# EAGLE design ME433 (EAGLE 9.6.2)
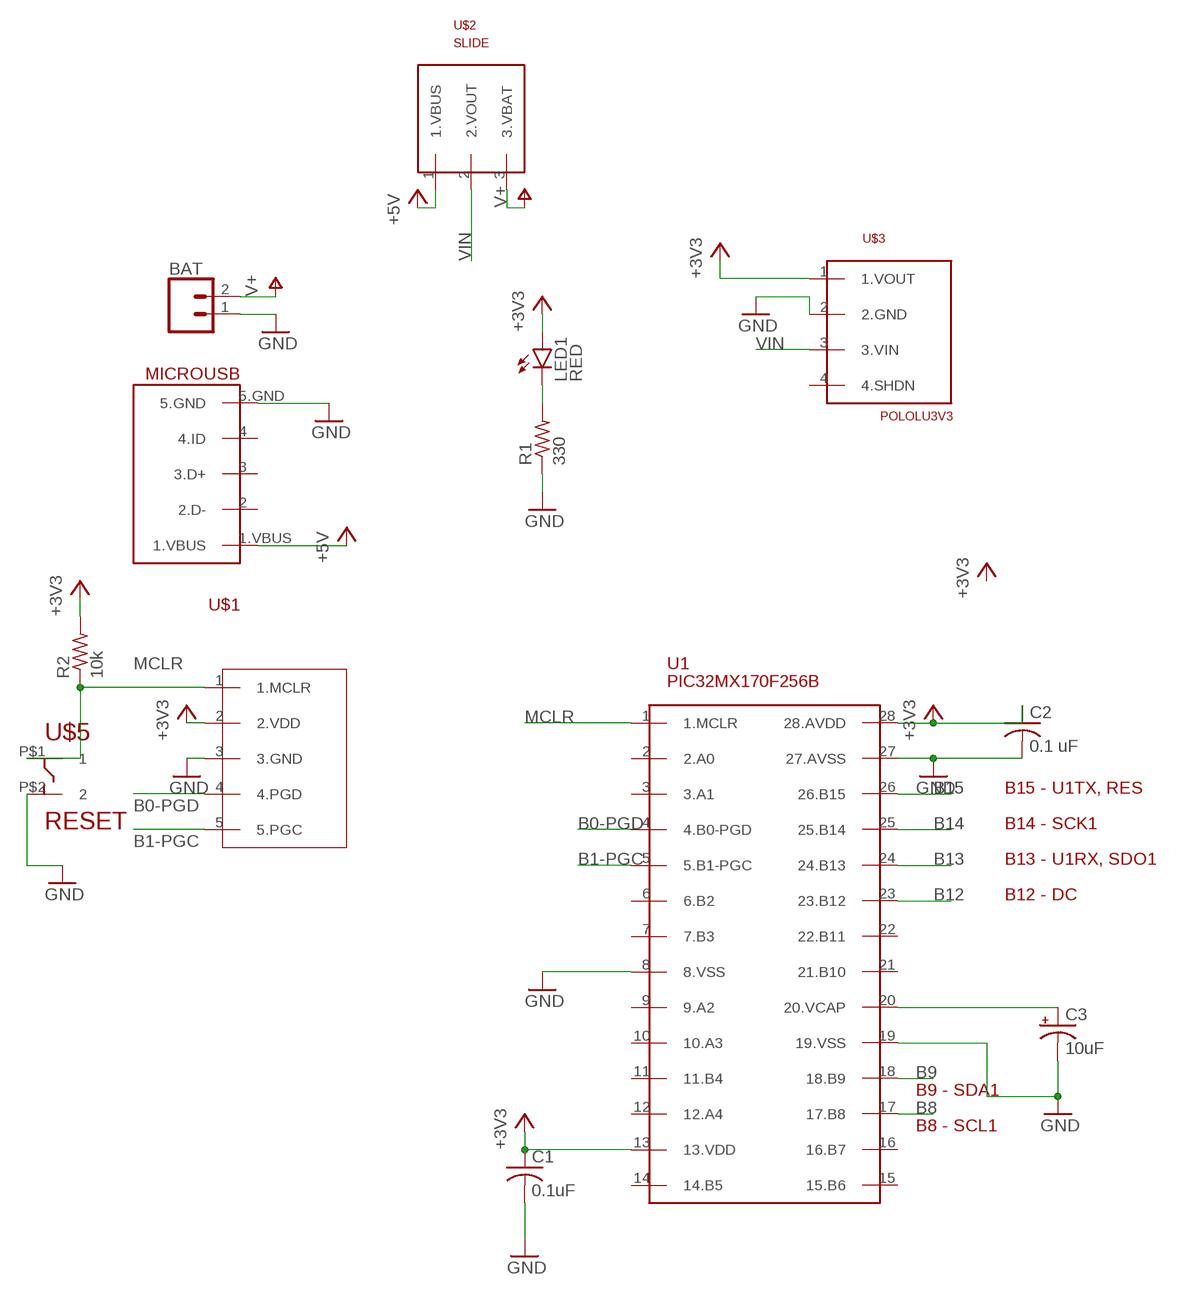
[diagram p0: schematic, sheet 1, part 1 of 2]
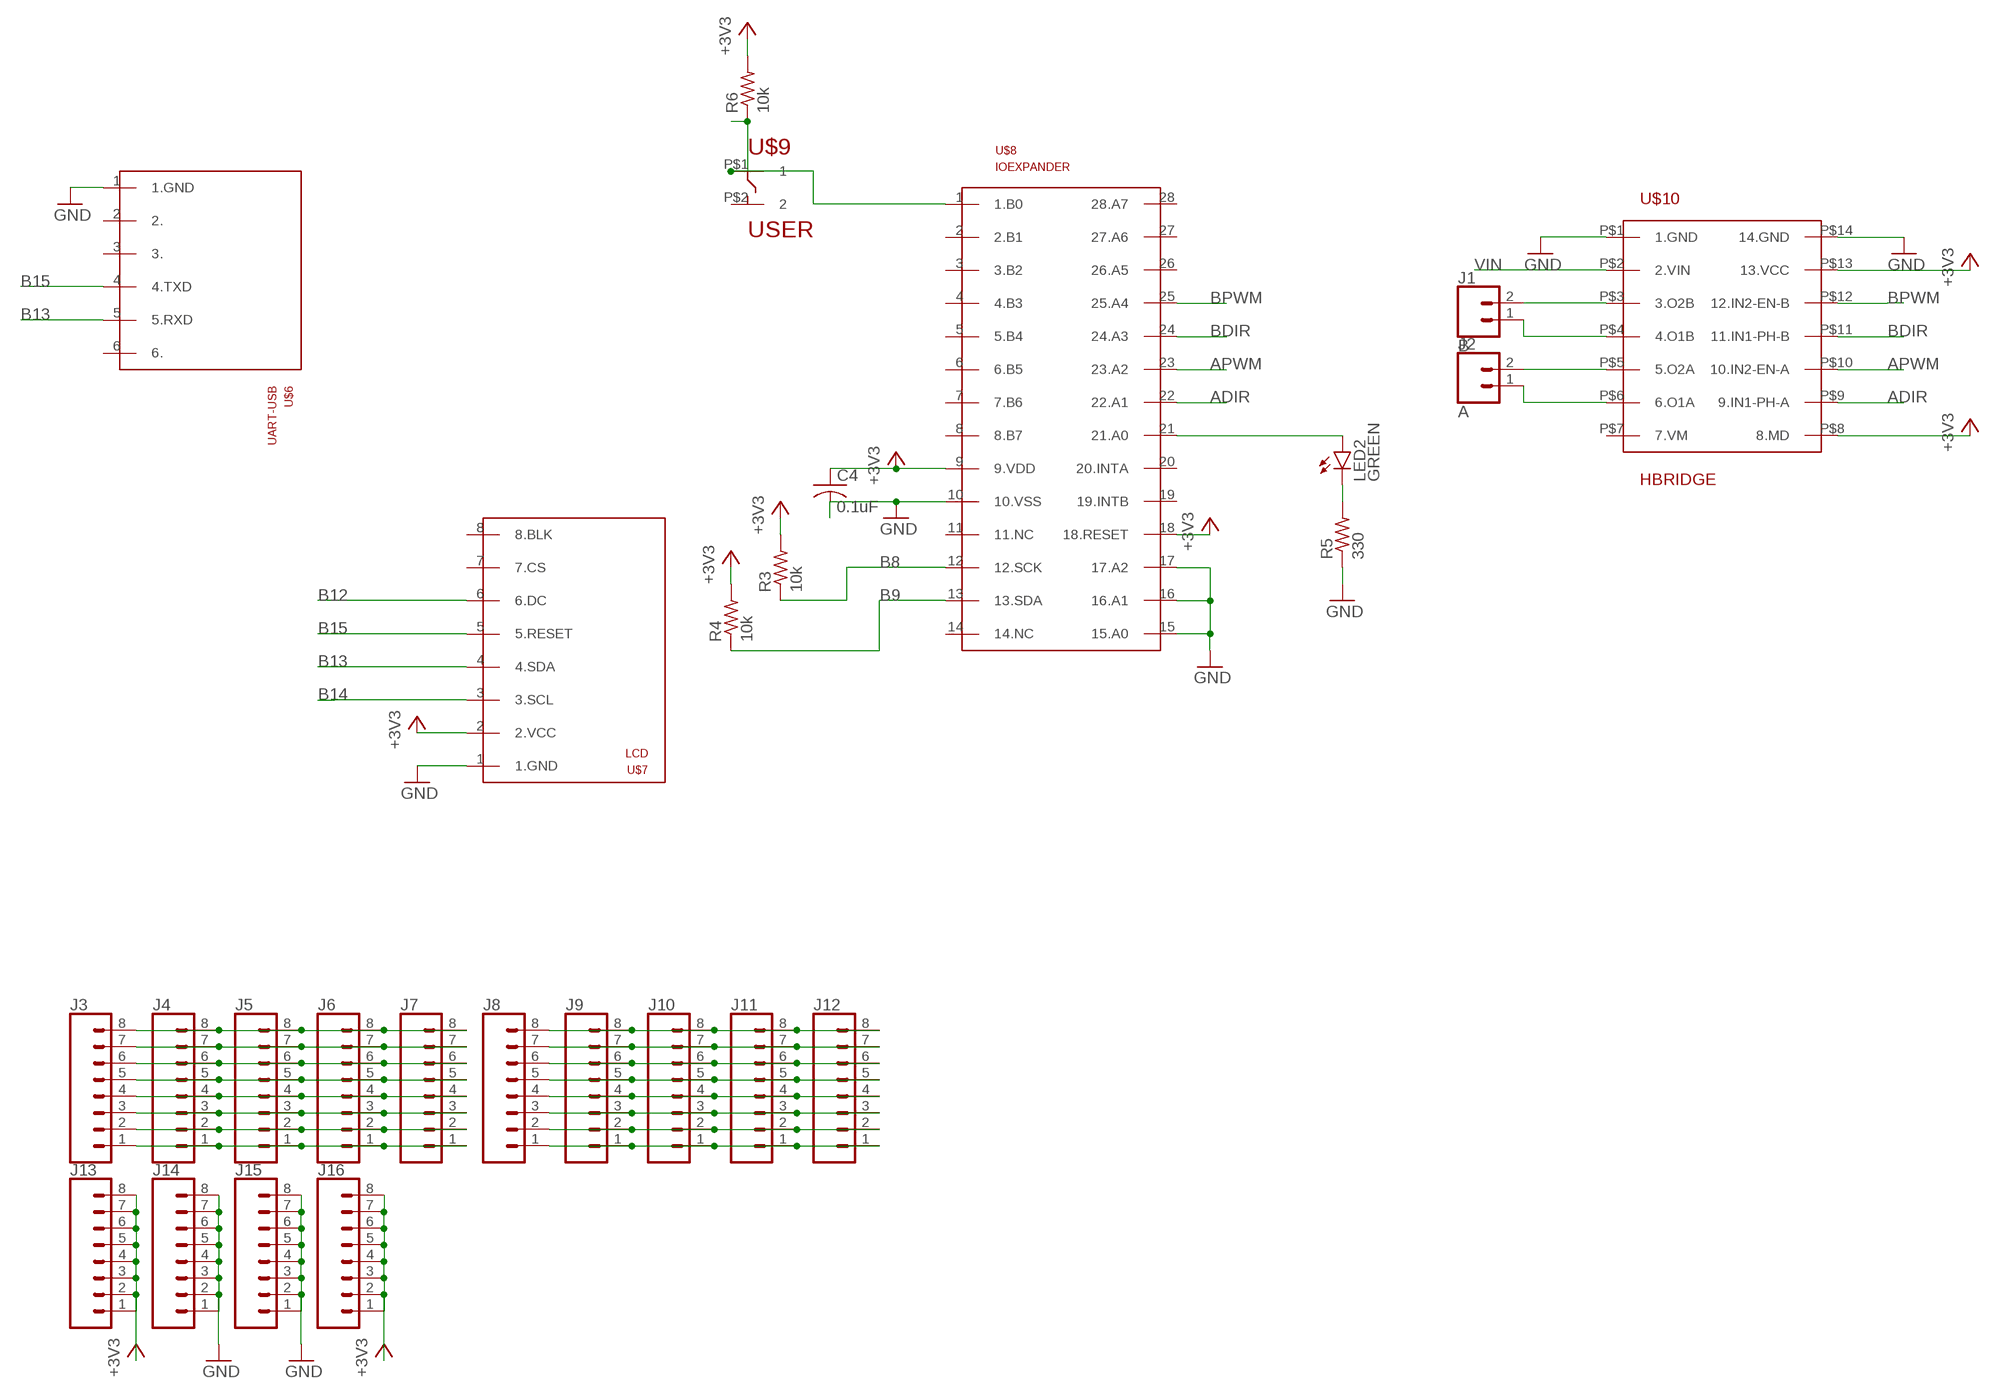
[diagram p1: schematic, sheet 1, part 2 of 2]

## Parts
BAT  CONN_02  [1X02]
C1  0.1uF  C-US025-030X050  [C025-030X050]
C2  0.1 uF  C-US025-030X050  [C025-030X050]
C3  10uF  CPOL-USB45181A  [B45181A]
C4  0.1uF  C-US025-030X050  [C025-030X050]
J1  B  CONN_02  [1X02]
J2  A  CONN_02  [1X02]
J3  CONN_08"  [1X08]
J4  CONN_08"  [1X08]
J5  CONN_08"  [1X08]
J6  CONN_08"  [1X08]
J7  CONN_08"  [1X08]
J8  CONN_08"  [1X08]
J9  CONN_08"  [1X08]
J10  CONN_08"  [1X08]
J11  CONN_08"  [1X08]
J12  CONN_08"  [1X08]
J13  CONN_08"  [1X08]
J14  CONN_08"  [1X08]
J15  CONN_08"  [1X08]
J16  CONN_08"  [1X08]
LED1  RED  LED3MM  [LED3MM]
LED2  GREEN  LED3MM  [LED3MM]
R1  330  R-US_0207/10  [0207/10]
R2  10k  R-US_0207/10  [0207/10]
R3  10k  R-US_0207/10  [0207/10]
R4  10k  R-US_0207/10  [0207/10]
R5  330  R-US_0207/10  [0207/10]
R6  10k  R-US_0207/10  [0207/10]
U1  PIC32MX170F256B  [DIL28-3]
U$1  MICROUSB  [MICROUSB]
U$2  SLIDE  [SLIDE]
U$3  POLOLU3V3  [POLOLU3V3]
U$4  SNAP  [SNAP]
U$5  RESET  PUSH  [PUSH]
U$6  UART-USB  [UART-USB]
U$7  LCD  [LCD]
U$8  IOEXPANDER  [IOEXPANDER]
U$9  USER  PUSH  [PUSH]
U$10  HBRIDGE  [HBRIDGE]

## Nets
+3V3: C1.1 C2.1 C4.1 J13.1 J13.2 J13.3 J13.4 J13.5 J13.6 J13.7 J13.8 J16.1 J16.2 J16.3 J16.4 J16.5 J16.6 J16.7 J16.8 LED1.A R2.2 R3.2 R4.2 R6.2 U1.13(13.VDD) U1.28(28.AVDD) U$3.1(1.VOUT) U$4.2(2.VDD) U$7.2(2.VCC) U$8.9(9.VDD) U$8.18(18.RESET) U$10.P$8(8.MD) U$10.P$13(13.VCC)
+5V: U$1.1.VBUS U$2.1(1.VBUS)
ADIR: U$8.22(22.A1) U$10.P$9(9.IN1-PH-A)
APWM: U$8.23(23.A2) U$10.P$10(10.IN2-EN-A)
B0-PGD: U1.4(4.B0-PGD) U$4.4(4.PGD)
B1-PGC: U1.5(5.B1-PGC) U$4.5(5.PGC)
B8: R3.1 U1.17(17.B8) U$8.12(12.SCK)
B9: R4.1 U1.18(18.B9) U$8.13(13.SDA)
B12: U1.23(23.B12) U$7.6(6.DC)
B13: U1.24(24.B13) U$6.5(5.RXD) U$7.4(4.SDA)
B14: U1.25(25.B14) U$7.3(3.SCL)
B15: U1.26(26.B15) U$6.4(4.TXD) U$7.5(5.RESET)
BDIR: U$8.24(24.A3) U$10.P$11(11.IN1-PH-B)
BPWM: U$8.25(25.A4) U$10.P$12(12.IN2-EN-B)
GND: BAT.1 C1.2 C2.2 C3.- C4.2 J14.1 J14.2 J14.3 J14.4 J14.5 J14.6 J14.7 J14.8 J15.1 J15.2 J15.3 J15.4 J15.5 J15.6 J15.7 J15.8 R1.1 R5.1 U1.8(8.VSS) U1.19(19.VSS) U1.27(27.AVSS) U$1.5.GND U$3.2(2.GND) U$4.3(3.GND) U$5.P$2 U$6.1(1.GND) U$7.1(1.GND) U$8.10(10.VSS) U$8.15(15.A0) U$8.16(16.A1) U$8.17(17.A2) U$10.P$1(1.GND) U$10.P$14(14.GND)
MCLR: R2.1 U1.1(1.MCLR) U$4.1(1.MCLR) U$5.P$1
N$1: LED1.K(C) R1.2
N$2: J1.2 U$10.P$3(3.O2B)
N$3: C3.+ U1.20(20.VCAP)
N$4: J1.1 U$10.P$4(4.O1B)
N$6: LED2.A U$8.21(21.A0)
N$7: LED2.K(C) R5.2
N$8: J2.2 U$10.P$5(5.O2A)
N$9: J2.1 U$10.P$6(6.O1A)
N$10: J3.8 J4.8 J5.8 J6.8 J7.8
N$11: J3.7 J4.7 J5.7 J6.7 J7.7
N$12: J3.6 J4.6 J5.6 J6.6 J7.6
N$13: J3.5 J4.5 J5.5 J6.5 J7.5
N$14: J3.4 J4.4 J5.4 J6.4 J7.4
N$15: J3.3 J4.3 J5.3 J6.3 J7.3
N$16: J3.2 J4.2 J5.2 J6.2 J7.2
N$17: J3.1 J4.1 J5.1 J6.1 J7.1
N$18: J8.8 J9.8 J10.8 J11.8 J12.8
N$19: J8.7 J9.7 J10.7 J11.7 J12.7
N$20: J8.6 J9.6 J10.6 J11.6 J12.6
N$21: J8.5 J9.5 J10.5 J11.5 J12.5
N$22: J8.4 J9.4 J10.4 J11.4 J12.4
N$23: J8.3 J9.3 J10.3 J11.3 J12.3
N$24: J8.2 J9.2 J10.2 J11.2 J12.2
N$25: J8.1 J9.1 J10.1 J11.1 J12.1
N$26: R6.1 U$8.1(1.B0) U$9.P$1
V+: BAT.2 U$2.3(3.VBAT)
VIN: U$2.2(2.VOUT) U$3.3(3.VIN) U$10.P$2(2.VIN)
Unconnected: U1.2(2.A0) U1.3(3.A1) U1.6(6.B2) U1.7(7.B3) U1.9(9.A2) U1.10(10.A3) U1.11(11.B4) U1.12(12.A4) U1.14(14.B5) U1.15(15.B6) U1.16(16.B7) U1.21(21.B10) U1.22(22.B11) U$1.2(2.D-) U$1.3(3.D+) U$1.4(4.ID) U$3.4(4.SHDN) U$6.2(2.) U$6.3(3.) U$6.6(6.) U$7.7(7.CS) U$7.8(8.BLK) U$8.2(2.B1) U$8.3(3.B2) U$8.4(4.B3) U$8.5(5.B4) U$8.6(6.B5) U$8.7(7.B6) U$8.8(8.B7) U$8.11(11.NC) U$8.14(14.NC) U$8.19(19.INTB) U$8.20(20.INTA) U$8.26(26.A5) U$8.27(27.A6) U$8.28(28.A7) U$9.P$2 U$10.P$7(7.VM)

## Notes on the sheet
- B15 - U1TX, RES
- B14 - SCK1
- B13 - U1RX, SDO1
- B12 - DC
- B9 - SDA1
- B8 - SCL1

## Library data of the parts
BAT J1 J2 = ME433:CONN_02: Multi connection point. Often used as Generic Header-pin footprint for 0.1 inch spaced/style header connections On any of the 0.1 inch spaced packages, you can populate with these: Break Away Headers - Straight <https://www.sparkfun.com/products/116> (PRT-00116) Break Away Male Headers - Right Angle <https://www.sparkfun.com/products/553> (PRT-00553) Female Headers <https://www.sparkfun.com/products/115> (PRT-00115) Break Away Headers - Machine Pin <https://www.sparkfun.com/products/117> (PRT-00117) Break Away Female Headers - Swiss Machine Pin <https://www.sparkfun.com/products/743> (PRT-00743) For SCREWTERMINALS and SPRING TERMINALS visit here: Screw Terimnals on SparkFun.com <https://www.sparkfun.com/search/results?term=Screw+Terminals> (5mm/3.5mm/2.54mm spacing) This device is also useful as a general connection point to wire up your design to another part of your project. Our various solder wires solder well into these plated through hole pads. Hook-Up Wire - Assortment (Stranded, 22 AWG) <https://www.sparkfun.com/products/11375> (PRT-11375) Hook-Up Wire - Assortment (Solid Core, 22 AWG) <https://www.sparkfun.com/products/11367> (PRT-11367) View the entire wire category on our website here <https://www.sparkfun.com/categories/141> Special notes: Molex polarized connector foot print use with: PRT-08233 with associated crimp pins and housings. 2.54_SCREWTERM for use with PRT-10571. 3.5mm Screw Terminal footprints for PRT-08084 5mm Screw Terminal footprints for use with PRT-08432
C1 C2 C4 = ME433:C-US: CAPACITOR, American symbol; SPICEPREFIX: C
C3 = ME433:CPOL-US: POLARIZED CAPACITOR, American symbol; SPICEPREFIX: C
J3-J16 = ME433:CONN_08: Multi connection point. Often used as Generic Header-pin footprint for 0.1 inch spaced/style header connections On any of the 0.1 inch spaced packages, you can populate with these: Break Away Headers - Straight <https://www.sparkfun.com/products/116> (PRT-00116) Break Away Male Headers - Right Angle <https://www.sparkfun.com/products/553> (PRT-00553) Female Headers <https://www.sparkfun.com/products/115> (PRT-00115) Break Away Headers - Machine Pin <https://www.sparkfun.com/products/117> (PRT-00117) Break Away Female Headers - Swiss Machine Pin <https://www.sparkfun.com/products/743> (PRT-00743) Arduino Stackable Header - 8 Pin <https://www.sparkfun.com/products/9279> (PRT-09279) For SCREWTERMINALS and SPRING TERMINALS visit here: Screw Terimnals on SparkFun.com <https://www.sparkfun.com/search/results?term=Screw+Terminals> (5mm/3.5mm/2.54mm spacing) This device is also useful as a general connection point to wire up your design to another part of your project. Our various solder wires solder well into these plated through hole pads. Hook-Up Wire - Assortment (Stranded, 22 AWG) <https://www.sparkfun.com/products/11375> (PRT-11375) Hook-Up Wire - Assortment (Solid Core, 22 AWG) <https://www.sparkfun.com/products/11367> (PRT-11367) View the entire wire category on our website here <https://www.sparkfun.com/categories/141> Special notes: Molex polarized connector foot print use with SKU : PRT-08231 with associated crimp pins and housings. 1MM SMD Version SKU: PRT-10208 NOTES ON THE VARIANTS LOCK and LOCK_LONGPADS... This footprint was designed to help hold the alignment of a through-hole component (i.e. 6-pin header) while soldering it into place. You may notice that each hole has been shifted either up or down by 0.005 of an inch from it's more standard position (which is a perfectly straight line). This slight alteration caused the pins (the squares in the middle) to touch the edges of the holes. Because they are alternating, it causes a "brace" to hold the component in place. 0.005 has proven to be the perfect amount of "off-center" position when using our standard breakaway headers. Although looks a little odd when you look at the bare footprint, once you have a header in there, the alteration is very hard to notice. Also,if you push a header all the way into place, it is covered up entirely on the bottom side.; PROD_ID: CONN-08438
LED1 LED2 = ME433:LED: LED OSRAM: - CHIPLED LG R971, LG N971, LY N971, LG Q971, LY Q971, LO R971, LY R971 LH N974, LH R974 LS Q976, LO Q976, LY Q976 LO Q996 - Hyper CHIPLED LW Q18S LB Q993, LB Q99A, LB R99A - SideLED LS A670, LO A670, LY A670, LG A670, LP A670 LB A673, LV A673, LT A673, LW A673 LH A674 LY A675 LS A676, LA A676, LO A676, LY A676, LW A676 LS A679, LY A679, LG A679 - Hyper Micro SIDELED® LS Y876, LA Y876, LO Y876, LY Y876 LT Y87S - SmartLED LW L88C, LW L88S LB L89C, LB L89S, LG L890 LS L89K, LO L89K, LY L89K LS L896, LA L896, LO L896, LY L896 - TOPLED LS T670, LO T670, LY T670, LG T670, LP T670 LSG T670, LSP T670, LSY T670, LOP T670, LYG T670 LG T671, LOG T671, LSG T671 LB T673, LV T673, LT T673, LW T673 LH T674 LS T676, LA T676, LO T676, LY T676, LB T676, LH T676, LSB T676, LW T676 LB T67C, LV T67C, LT T67C, LS T67K, LO T67K, LY T67K, LW E67C LS E67B, LA E67B, LO E67B, LY E67B, LB E67C, LV E67C, LT E67C LW T67C LS T679, LY T679, LG T679 LS T770, LO T770, LY T770, LG T770, LP T770 LB T773, LV T773, LT T773, LW T773 LH T774 LS E675, LA E675, LY E675, LS T675 LS T776, LA T776, LO T776, LY T776, LB T776 LHGB T686 LT T68C, LB T68C - Hyper Mini TOPLED® LB M676 - Mini TOPLED Santana® LG M470 LS M47K, LO M47K, LY M47K Source: http://www.osram.convergy.de LUXEON: - LUMILED® LXK2-PW12-R00, LXK2-PW12-S00, LXK2-PW14-U00, LXK2-PW14-V00 LXK2-PM12-R00, LXK2-PM12-S00, LXK2-PM14-U00 LXK2-PE12-Q00, LXK2-PE12-R00, LXK2-PE12-S00, LXK2-PE14-T00, LXK2-PE14-U00 LXK2-PB12-K00, LXK2-PB12-L00, LXK2-PB12-M00, LXK2-PB14-N00, LXK2-PB14-P00, LXK2-PB14-Q00 LXK2-PR12-L00, LXK2-PR12-M00, LXK2-PR14-Q00, LXK2-PR14-R00 LXK2-PD12-Q00, LXK2-PD12-R00, LXK2-PD12-S00 LXK2-PH12-R00, LXK2-PH12-S00 LXK2-PL12-P00, LXK2-PL12-Q00, LXK2-PL12-R00 Source: www.luxeon.com KINGBRIGHT: KA-3528ASYC Source: www.kingbright.com
R1-R6 = ME433:R-US_: RESISTOR, American symbol; SPICEPREFIX: R
U1 = ME433:PIC32MX170F256B
U$1 = ME433:MICROUSB
U$2 = ME433:SLIDE
U$3 = ME433:POLOLU3V3
U$4 = ME433:SNAP
U$5 U$9 = ME433:PUSH
U$6 = ME433:UART-USB
U$7 = ME433:LCD
U$8 = ME433:IOEXPANDER
U$10 = ME433:HBRIDGE

## Board
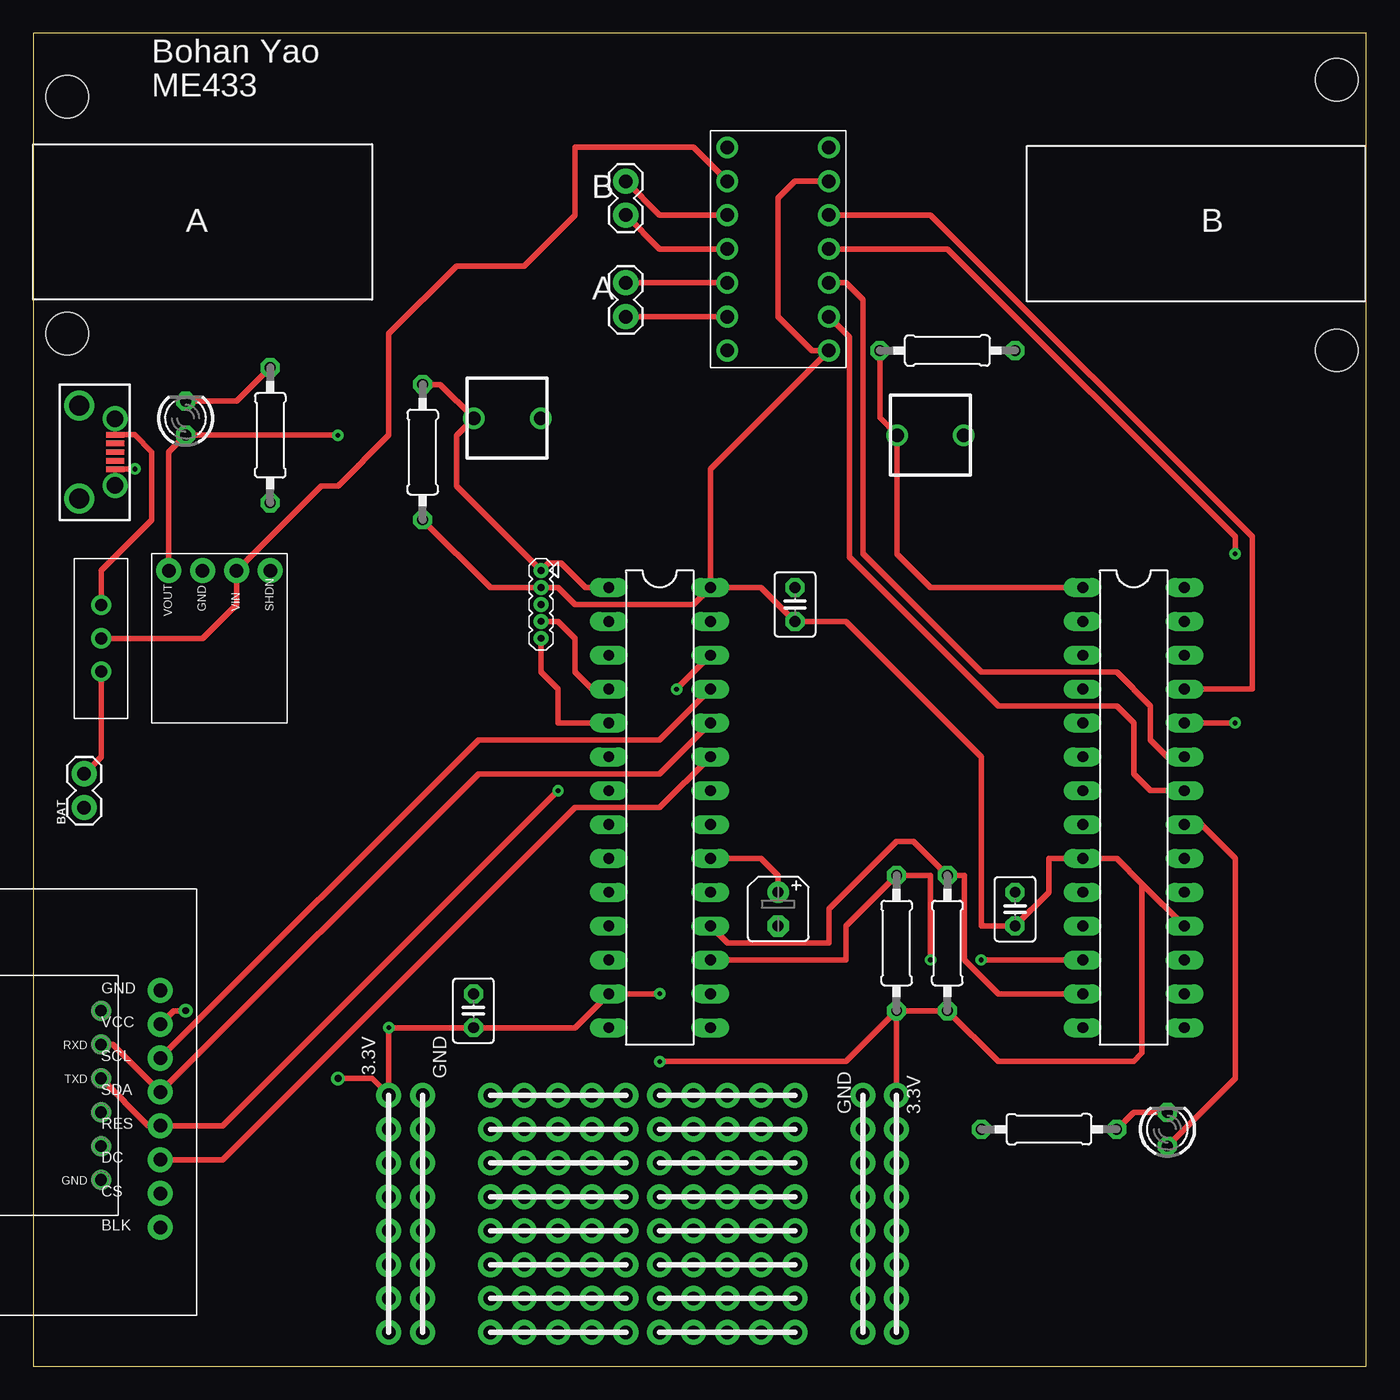
[diagram p2: board, top side]
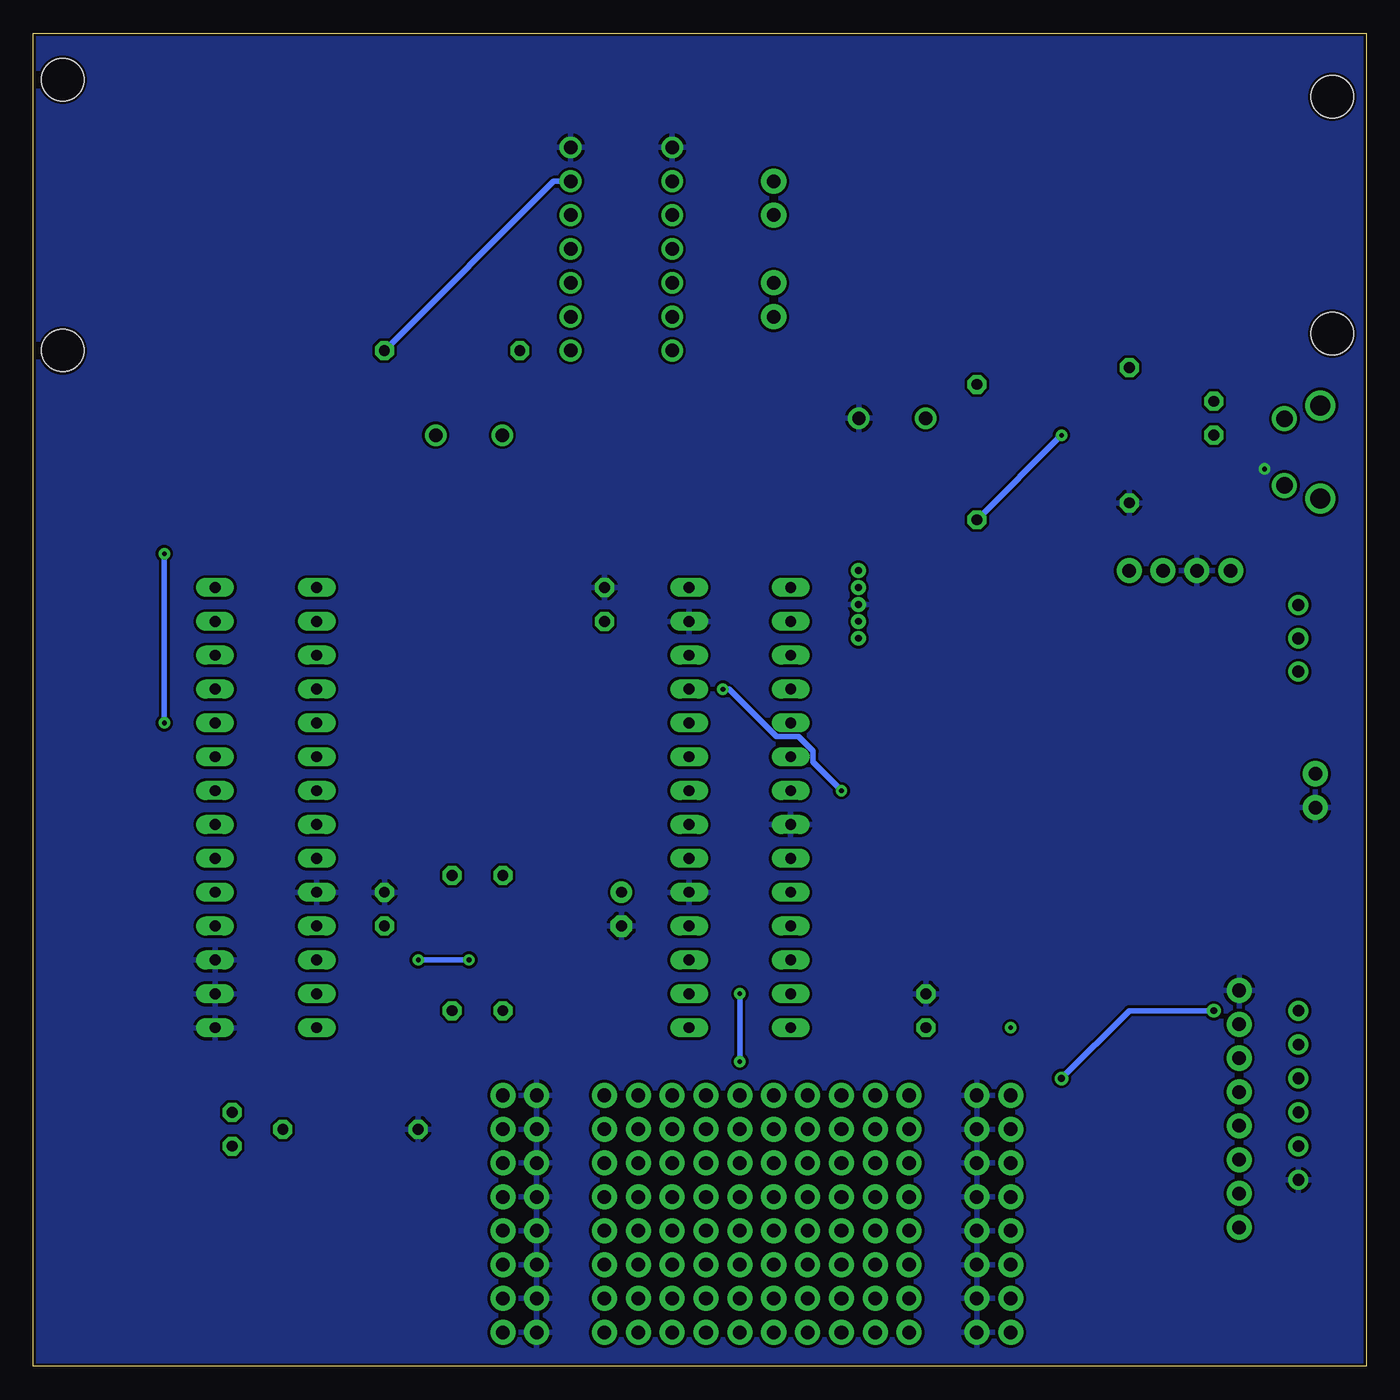
[diagram p3: board, bottom side, seen from below]

Size 100 x 100 mm. Coordinates in mm from the lower left corner, seen from the top.
Outline: 0,0 100,0 100,100 0,100 0,0
Copper layers (1*16): Top 0.035mm / dielectric 1.5mm / Bottom 0.035mm
Design rules "SparkFun": minimum track width 8mil, minimum drill 20mil, track to track 8mil, track to pad 8mil, pad to pad 8mil, via to via 8mil, smd to smd 8mil, copper to edge 8mil, drill to drill 8mil, minimum pad ring 12mil, minimum via ring 10mil, stop-mask expansion 4mil, vias tented up to drill 20mil, thermal gap 10mil
Holes 3.17 mm at 2.54,95.25 2.54,77.47 97.79,96.52 97.79,76.2

### Footprints (pad centres in the part's own frame; a part is rotated, then mirrored left to right if it is on the bottom)
1X02 = drill 1.016 pad 1.88: 1 0,0; 2 2.54,0
C025-030X050 = drill 0.813 octagon: 1 -1.27,0; 2 1.27,0
B45181A = drill 0.813 pad 1.6: + -1.27,0 | drill 0.813 pad 1.6 octagon: - 1.27,0
1X08 = drill 1.016 pad 1.88: 1 0,0; 2 2.54,0; 3 5.08,0; 4 7.62,0; 5 10.16,0; 6 12.7,0; 7 15.24,0; 8 17.78,0
LED3MM = drill 0.813 octagon: A -1.27,0; K 1.27,0
0207/10 = drill 0.813 octagon: 1 -5.08,0; 2 5.08,0
DIL28-3 = drill 0.813 long: 1 -16.51,-3.81; 2 -13.97,-3.81; 3 -11.43,-3.81; 4 -8.89,-3.81; 5 -6.35,-3.81; 6 -3.81,-3.81; 7 -1.27,-3.81; 8 1.27,-3.81; 9 3.81,-3.81; 10 6.35,-3.81; 11 8.89,-3.81; 12 11.43,-3.81; 13 13.97,-3.81; 14 16.51,-3.81; 15 16.51,3.81; 16 13.97,3.81; 17 11.43,3.81; 18 8.89,3.81; 19 6.35,3.81; 20 3.81,3.81; 21 1.27,3.81; 22 -1.27,3.81; 23 -3.81,3.81; 24 -6.35,3.81; 25 -8.89,3.81; 26 -11.43,3.81; 27 -13.97,3.81; 28 -16.51,3.81
MICROUSB = smd 0.4 x 1.35: 1.VBUS -1.3,2.7; 2 -0.65,2.7; 3 0,2.7; 4 0.65,2.7; 5.GND 1.3,2.7 | drill 1.25 pad 1.676: P$6 -2.5,2.7; P$7 2.5,2.7 | drill 1.5: P$8 -3.5,0; P$9 3.5,0
SLIDE = drill 0.9: 1 -2.5,0; 2 0,0; 3 2.5,0
POLOLU3V3 = drill 1.016 pad 1.88: 1 0,3.81; 2 0,1.27; 3 0,-1.27; 4 0,-3.81
SNAP = drill 0.508 pad 1: 1 1.27,0; 2 1.27,-1.27; 3 1.27,-2.54; 4 1.27,-3.81; 5 1.27,-5.08
PUSH = drill 1: P$1 -2.5,0; P$2 2.5,0
UART-USB = drill 0.889 pad 0.813: 1 -6.35,1.27; 2 -3.81,1.27; 3 -1.27,1.27; 4 1.27,1.27; 5 3.81,1.27; 6 6.35,1.27
LCD = drill 1.016 pad 1.88: 1 41.275,24.384; 2 41.275,21.844; 3 41.275,19.304; 4 41.275,16.764; 5 41.275,14.224; 6 41.275,11.684; 7 41.275,9.144; 8 41.275,6.604
IOEXPANDER = drill 0.813 long: 1 -16.51,-3.81; 2 -13.97,-3.81; 3 -11.43,-3.81; 4 -8.89,-3.81; 5 -6.35,-3.81; 6 -3.81,-3.81; 7 -1.27,-3.81; 8 1.27,-3.81; 9 3.81,-3.81; 10 6.35,-3.81; 11 8.89,-3.81; 12 11.43,-3.81; 13 13.97,-3.81; 14 16.51,-3.81; 15 16.51,3.81; 16 13.97,3.81; 17 11.43,3.81; 18 8.89,3.81; 19 6.35,3.81; 20 3.81,3.81; 21 1.27,3.81; 22 -1.27,3.81; 23 -3.81,3.81; 24 -6.35,3.81; 25 -8.89,3.81; 26 -11.43,3.81; 27 -13.97,3.81; 28 -16.51,3.81
HBRIDGE = drill 1.016: P$1 -2.54,7.62; P$2 -2.54,5.08; P$3 -2.54,2.54; P$4 -2.54,0; P$5 -2.54,-2.54; P$6 -2.54,-5.08; P$7 -2.54,-7.62; P$8 5.08,-7.62; P$9 5.08,-5.08; P$10 5.08,-2.54; P$11 5.08,0; P$12 5.08,2.54; P$13 5.08,5.08; P$14 5.08,7.62

### Placement (x,y rotation side)
BAT  3.81,41.91 90 top
C1  57.15,57.15 90 top
C2  33.02,26.67 90 top
C3  55.88,34.29 270 top
C4  73.66,34.29 90 top
J1  44.45,86.36 90 top
J2  44.45,78.74 90 top
J3  34.29,2.54 90 top
J4  36.83,2.54 90 top
J5  39.37,2.54 90 top
J6  41.91,2.54 90 top
J7  44.45,2.54 90 top
J8  46.99,2.54 90 top
J9  49.53,2.54 90 top
J10  52.07,2.54 90 top
J11  54.61,2.54 90 top
J12  57.15,2.54 90 top
J13  26.67,2.54 90 top
J14  29.21,2.54 90 top
J15  62.23,2.54 90 top
J16  64.77,2.54 90 top
LED1  11.43,71.12 90 top
LED2  85.09,17.78 90 top
R1  17.78,69.85 90 top
R2  29.21,68.58 270 top
R3  64.77,31.75 270 top
R4  68.58,31.75 270 top
R5  76.2,17.78 0 top
R6  68.58,76.2 0 top
U1  46.99,41.91 270 top
U$1  3.43,68.58 270 top
U$2  5.08,54.61 270 top
U$3  13.97,59.69 90 top
U$4  36.83,59.69 0 top
U$5  35.56,71.12 0 top
U$6  6.35,20.32 90 top
U$7  -31.75,3.81 0 top
U$8  82.55,41.91 270 top
U$9  67.31,69.85 0 top
U$10  54.61,83.82 0 top

### Tracks (layer width: path | path; a pad name or v marks a point on that pad's centre or on a via)
+3V3  (via drill 0.35, 0.51)
  Top 0.406: U$3.1 10.16,68.58 LED1.A v22.86,69.85 | R2.2 34.29,58.42 U$4.2 39.37,58.42 40.64,57.15 49.53,57.15 U1.28 | U1.28 54.61,58.42 C1.1 60.96,55.88 71.12,45.72 71.12,33.02 C4.1 76.2,35.56 76.2,38.1 U$8.9 81.28,38.1 83.19,36.2 | U1.28 50.8,67.31 U$10.P$8 58.42,76.2 55.88,78.74 55.88,87.63 57.15,88.9 U$10.P$13 | 83.19,36.2 U$8.18 | 83.19,36.2 83.19,23.5 82.55,22.86 72.39,22.86 R4.2 R3.2 | R3.2 J16.8 J16.7 J16.6 J16.5 J16.4 J16.3 J16.2 J16.1 | R3.2 60.96,22.86 v46.99,22.86 | v46.99,27.94 U1.13 40.64,25.4 C2.1 v26.67,25.4 J13.8 | J13.8 J13.7 J13.6 J13.5 J13.4 J13.3 J13.2 J13.1 | v11.43,26.67 10.54,26.67 U$7.2 | v22.86,21.59 25.4,21.59 J13.8
  Bottom 0.406: v22.86,69.85 R2.2 | v46.99,22.86 v46.99,27.94 | U$10.P$13 60.96,88.9 R6.2 | v11.43,26.67 17.78,26.67 v22.86,21.59
+5V
  Top 0.406: U$1.1.VBUS 7.59,69.88 8.89,68.58 8.89,63.5 5.08,59.69 U$2.1
ADIR
  Top 0.406: U$10.P$9 61.21,77.22 61.21,60.71 72.39,49.53 81.28,49.53 82.55,48.26 82.55,44.45 83.82,43.18 U$8.22
APWM
  Top 0.406: U$10.P$10 60.96,81.28 62.23,80.01 62.23,60.96 71.12,52.07 81.28,52.07 83.82,49.53 83.82,46.99 85.09,45.72 U$8.23
B0-PGD
  Top 0.406: U$4.4 39.37,55.88 40.64,54.61 40.64,52.07 41.91,50.8 U1.4
B1-PGC
  Top 0.406: U$4.5 38.1,52.07 39.37,50.8 39.37,48.26 U1.5
B8  (via drill 0.35)
  Top 0.406: U$8.12 v71.12,30.48 | v67.31,30.48 67.31,36.83 R3.1 60.96,33.02 60.96,30.48 U1.17
  Bottom 0.406: v71.12,30.48 v67.31,30.48
B9
  Top 0.406: U$8.13 72.39,27.94 69.85,30.48 69.85,36.83 R4.1 66.04,39.37 64.77,39.37 59.69,34.29 59.69,31.75 52.07,31.75 U1.18
B12
  Top 0.406: U$7.6 14.22,15.49 40.64,41.91 46.99,41.91 U1.23
B13
  Top 0.406: U1.24 46.99,44.45 33.4,44.45 U$7.4 5.97,24.13 U$6.5
B14
  Top 0.406: U$7.3 33.4,46.99 46.99,46.99 U1.25
B15  (via drill 0.35)
  Top 0.406: v39.37,43.18 14.22,18.03 10.16,18.03 U$7.5 8.64,18.03 U$6.4 | v48.26,50.8 U1.26
  Bottom 0.406: v39.37,43.18 41.5,45.31 41.5,46.14 42.61,47.24 44.26,47.24 47.82,50.8 v48.26,50.8
BDIR  (via drill 0.35)
  Top 0.406: U$10.P$11 68.58,83.82 90.17,62.23 v90.17,60.96 | v90.17,48.26 U$8.24
  Bottom 0.406: v90.17,60.96 v90.17,48.26
BPWM
  Top 0.406: U$10.P$12 67.31,86.36 91.44,62.23 91.44,50.8 U$8.25
GND  (via drill 0.35)
  Top 0.406: U$1.5.GND 6.16,67.31 v7.62,67.31
  pour Bottom (isolate 0): 0,0 100.33,0 100.33,100.33 0,100.33
MCLR
  Top 0.406: U1.1 41.43,58.42 39.6,60.25 38.66,60.25 U$4.1 31.75,66.04 31.75,69.81 U$5.P$1 30.52,73.66 R2.1
N$1
  Top 0.406: LED1.K 15.24,72.39 R1.2
N$2
  Top 0.406: J1.2 46.99,86.36 U$10.P$3
N$3
  Top 0.406: C3.+ 55.88,36.83 54.61,38.1 U1.20
N$4
  Top 0.406: U$10.P$4 46.99,83.82 J1.1
N$6
  Top 0.406: LED2.A 90.17,21.59 90.17,38.1 87.63,40.64 U$8.21
N$7
  Top 0.406: R5.2 82.55,19.05 LED2.K
N$8
  Top 0.406: J2.2 U$10.P$5
N$9
  Top 0.406: U$10.P$6 J2.1
N$10
  Top 0.406: J3.8 J4.8 J5.8 J6.8 J7.8
N$11
  Top 0.406: J3.7 J4.7 J5.7 J6.7 J7.7
N$12
  Top 0.406: J3.6 J4.6 J5.6 J6.6 J7.6
N$13
  Top 0.406: J3.5 J4.5 J5.5 J6.5 J7.5
N$14
  Top 0.406: J3.4 J4.4 J5.4 J6.4 J7.4
N$15
  Top 0.406: J3.3 J4.3 J5.3 J6.3 J7.3
N$16
  Top 0.406: J3.2 J4.2 J5.2 J6.2 J7.2
N$17
  Top 0.406: J3.1 J4.1 J5.1 J6.1 J7.1
N$18
  Top 0.406: J8.8 J9.8 J10.8 J11.8 J12.8
N$19
  Top 0.406: J12.7 J11.7 J10.7 J9.7 J8.7
N$20
  Top 0.406: J8.6 J9.6 J10.6 J11.6 J12.6
N$21
  Top 0.406: J12.5 J11.5 J10.5 J9.5 J8.5
N$22
  Top 0.406: J8.4 J9.4 J10.4 J11.4 J12.4
N$23
  Top 0.406: J8.3 J9.3 J10.3 J11.3 J12.3
N$24
  Top 0.406: J12.2 J11.2 J10.2 J9.2 J8.2
N$25
  Top 0.406: J8.1 J9.1 J10.1 J11.1 J12.1
N$26
  Top 0.406: R6.1 63.5,71.16 U$9.P$1 64.81,60.92 67.31,58.42 U$8.1
V+
  Top 0.406: BAT.2 5.08,45.72 U$2.3
VIN
  Top 0.406: U$2.2 12.7,54.61 15.24,57.15 U$3.3 21.59,66.04 22.86,66.04 26.67,69.85 26.67,77.47 31.75,82.55 36.83,82.55 40.64,86.36 40.64,91.44 49.53,91.44 U$10.P$2

### Text on the board
tPlace: Bohan Yao | ME433 | B | A | B | A | 3.3V | GND | GND | 3.3V